# Altium project Nguon cam bien.PrjPcb
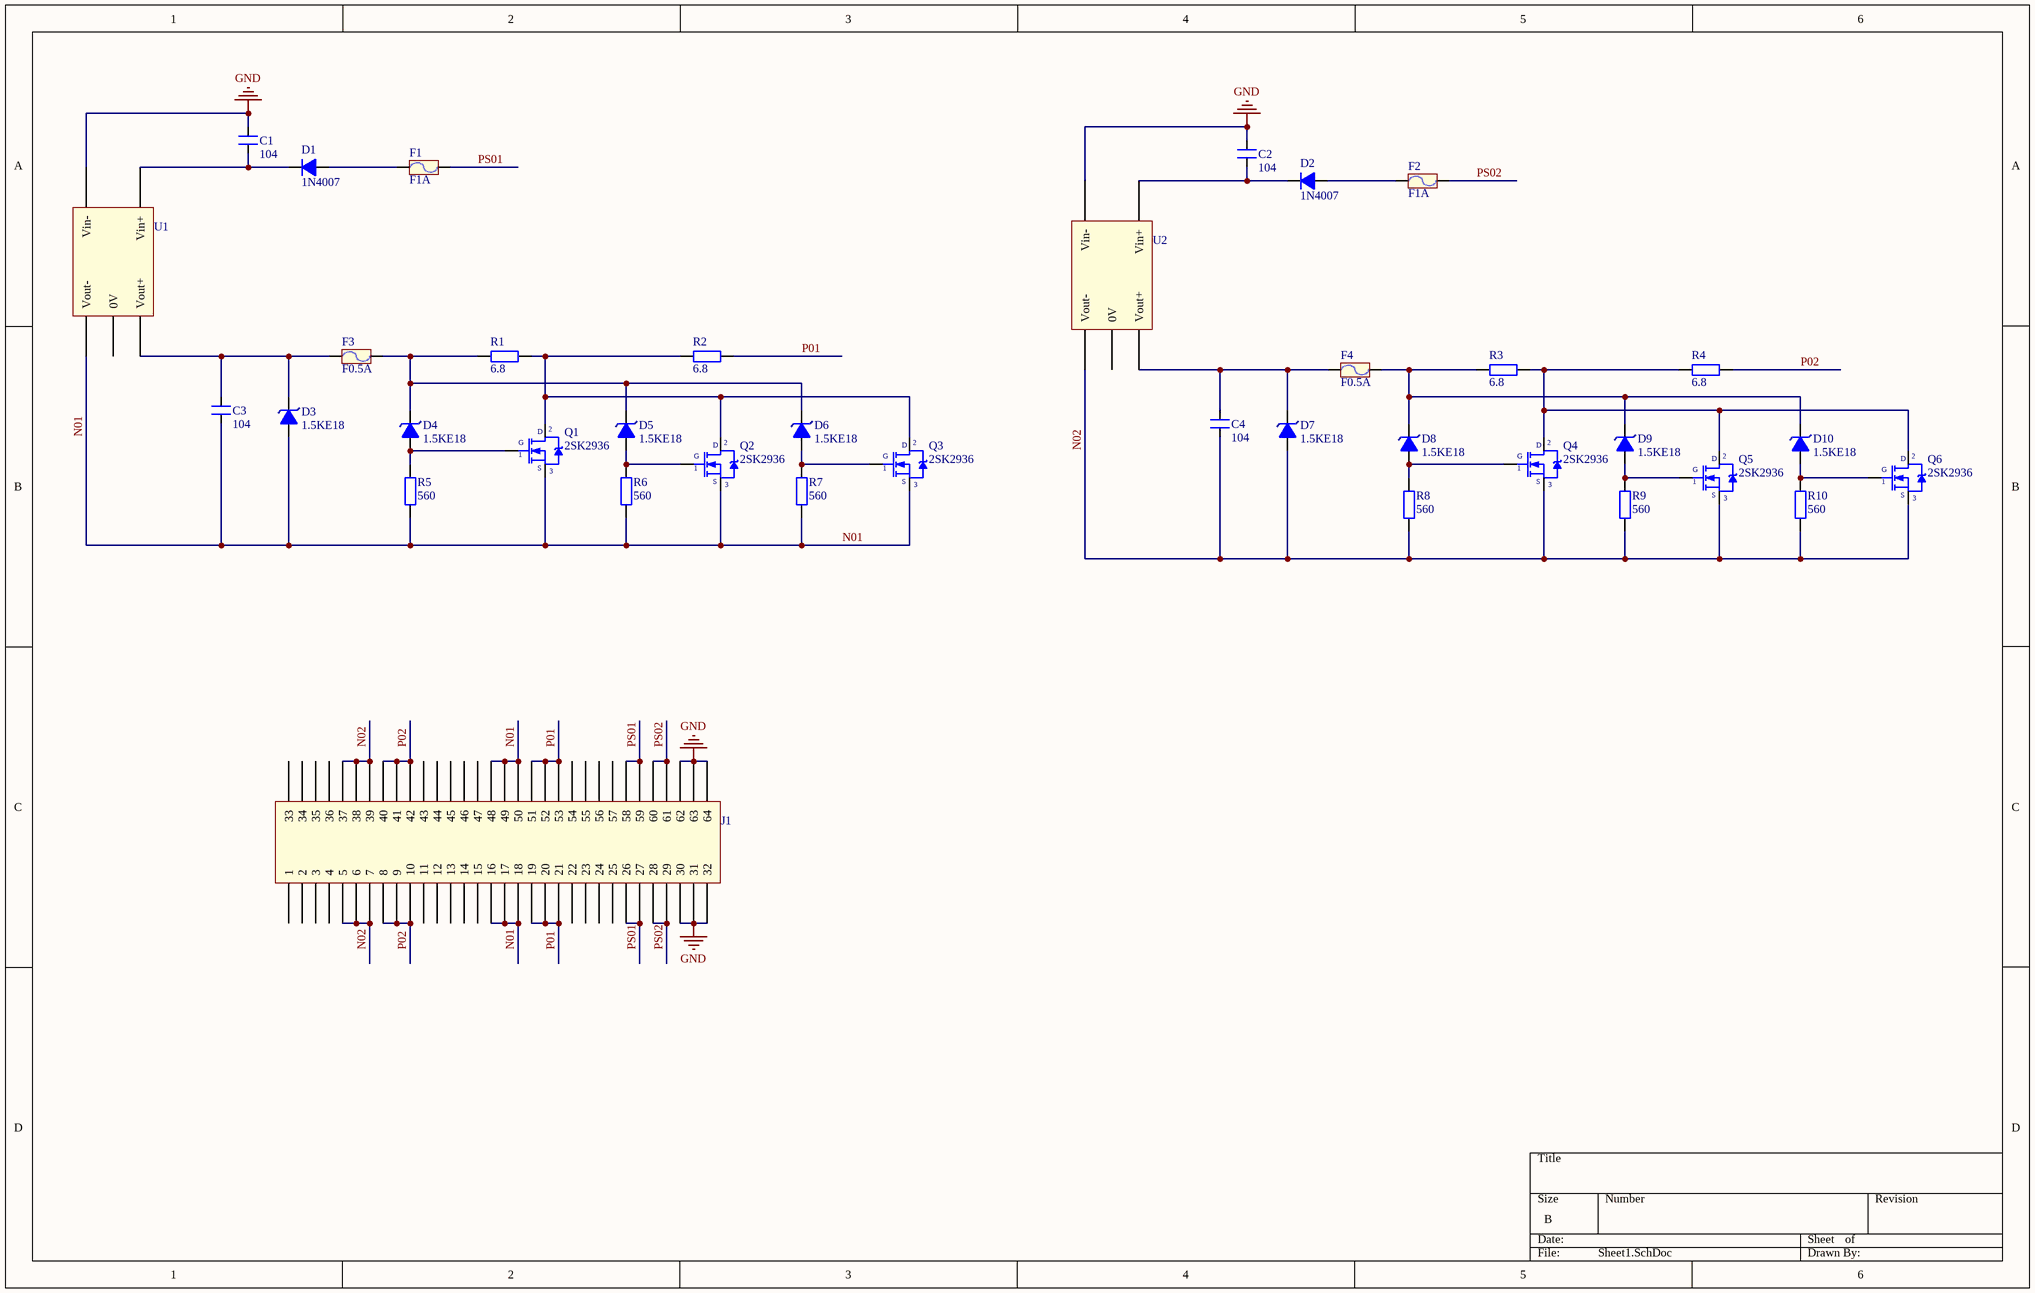
[diagram p0: Sheet1.SchDoc]
1 sheet, 37 parts. Net scope: global (net labels, ports and power ports of the same name join across sheets).
Board file: PCB1.PcbDoc

## Sheet Sheet1.SchDoc
size B

### Parts
C1  104  [CN1]
C2  104  [CN1]
C3  104  [CN1]
C4  104  [CN1]
D1  1N4007  [D1A]
D2  1N4007  [D1A]
D3  1.5KE18  [D1A]
D4  1.5KE18  [D1A]
D5  1.5KE18  [D1A]
D6  1.5KE18  [D1A]
D7  1.5KE18  [D1A]
D8  1.5KE18  [D1A]
D9  1.5KE18  [D1A]
D10  1.5KE18  [D1A]
F1  F1A  [Fuse]
F2  F1A  [Fuse]
F3  F0.5A  [Fuse]
F4  F0.5A  [Fuse]
J1  Header 32x2  [Header32x2]  (value not drawn)
Q1  2SK2936  [QTO-220]
Q2  2SK2936  [QTO-220]
Q3  2SK2936  [QTO-220]
Q4  2SK2936  [QTO-220]
Q5  2SK2936  [QTO-220]
Q6  2SK2936  [QTO-220]
R1  6.8  [R5W]
R2  6.8  [R5W]
R3  6.8  [R5W]
R4  6.8  [R5W]
R5  560  [R1/4W]
R6  560  [R1/4W]
R7  560  [R1/4W]
R8  560  [R1/4W]
R9  560  [R1/4W]
R10  560  [R1/4W]
U1  WRx-YMD-6W  [WRB-YMD-6W]  (value not drawn)
U2  WRx-YMD-6W  [WRB-YMD-6W]  (value not drawn)

### Nets
GND: C1.2 C2.2 J1.30 J1.31 J1.32 J1.62 J1.63 J1.64 U1.1(Vin-) U2.1(Vin-)
N01: C3.1 D3.1(A) J1.16 J1.17 J1.18 J1.48 J1.49 J1.50 Q1.3(S) Q2.3(S) Q3.3(S) R5.1 R6.1 R7.1 U1.5(Vout-)
N02: C4.1 D7.1(A) J1.5 J1.6 J1.7 J1.37 J1.38 J1.39 Q4.3(S) Q5.3(S) Q6.3(S) R8.1 R9.1 R10.1 U2.5(Vout-)
P01: J1.19 J1.20 J1.21 J1.51 J1.52 J1.53 R2.1
P02: J1.8 J1.9 J1.10 J1.40 J1.41 J1.42 R4.1
PS01: F1.2 J1.26 J1.27 J1.58 J1.59
PS02: F2.2 J1.28 J1.29 J1.60 J1.61
NetC1_1: C1.1 D1.2(K) U1.2(Vin+)
NetC2_1: C2.1 D2.2(K) U2.2(Vin+)
NetC3_2: C3.2 D3.2(K) F3.2 U1.3(Vout+)
NetC4_2: C4.2 D7.2(K) F4.2 U2.3(Vout+)
NetD1_1: D1.1(A) F1.1
NetD2_1: D2.1(A) F2.1
NetD4_1: D4.1(A) Q1.1(G) R5.2
NetD4_2: D4.2(K) D5.2(K) D6.2(K) F3.1 R1.2
NetD5_1: D5.1(A) Q2.1(G) R6.2
NetD6_1: D6.1(A) Q3.1(G) R7.2
NetD8_1: D8.1(A) Q4.1(G) R8.2
NetD8_2: D8.2(K) D9.2(K) D10.2(K) F4.1 R3.2
NetD9_1: D9.1(A) Q5.1(G) R9.2
NetD10_1: D10.1(A) Q6.1(G) R10.2
NetQ1_2: Q1.2(D) Q2.2(D) Q3.2(D) R1.1 R2.2
NetQ4_2: Q4.2(D) Q5.2(D) Q6.2(D) R3.1 R4.2

Not connected (* = marked no-connect by the designer): J1 1 2 3 4 11 12 13 14 15 22 23 24 25 33 34 35 36 43 44 45 46 47 54 55 56 57; U1 4(0V); U2 4(0V)

### Library data of the parts
C1-C4 = CAP: Cremic For Xtal 1pF => 100pF; Value: 33pF
D1 D2 = D1A: Diode 1A; Value: 1N4007
D3-D10 = Zener
F1-F4 = Fuse: Designed by: VanDungEvn; Value: Fuse
Q1-Q6 = IRF840: MOSFET N - CHANNEL 500V - 0.75 - 8A - TO-220; Value: IRF840
R1-R10 = R1/4W: Resistor 1/4W; Value: R1/4W - 1K
U1 U2 = WRB-YMD-6W